# Altium project CAPTIVATE-PGMR.PrjPcb (part 1 of 3)
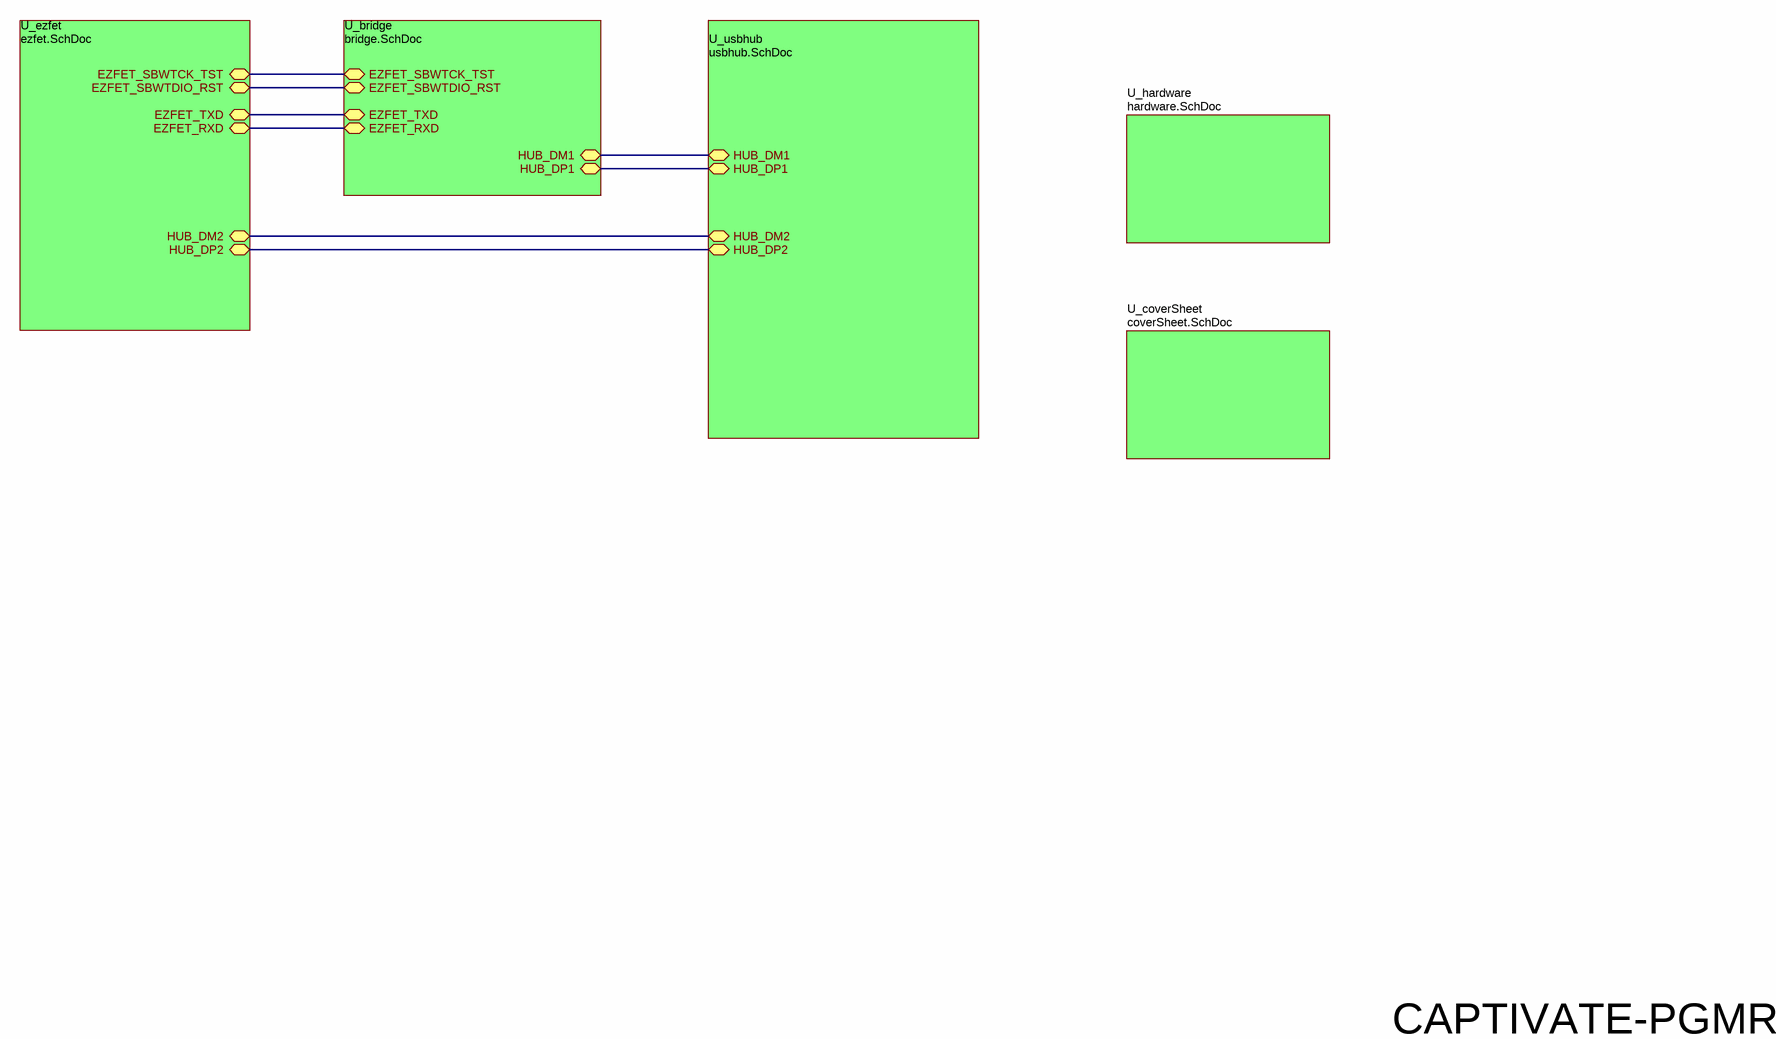
[diagram p0: TopSheet.SchDoc]
CopyrightYear: 2014; CountryOfManufacture: U.S.; EVM_orderable: CAPTIVATE-PGMR; PCB_Layout: Dennis Lehman; PCB_Rev: C; PRJ_Customer: Public Release; PRJ_Engineer: Dennis Lehman; PRJ_Number: CAPTIVATE-PGMR; PRJ_Title: TICAPEVM-430PGMR; SCH_Rev: B; TechSupport: http://www.ti.com/support; VariantName: Production Release
6 sheets, 160 parts. Net scope: hierarchical (ports join the sheet entries above them; power ports are global).
Board file: captivate_pgmr.PcbDoc
Sheets:
  TopSheet.SchDoc
    U_usbhub = usbhub.SchDoc
    U_ezfet = ezfet.SchDoc
    U_bridge = bridge.SchDoc
    U_hardware = hardware.SchDoc
    U_coverSheet = coverSheet.SchDoc

## Sheet TopSheet.SchDoc
size 431 x 279 mm; Date: Not shown in title block; ApprovedBy: Not shown in title block; CheckedBy: Not shown in title block; Author: Not shown in title block; CompanyName: Not shown in title block; Engineer: Not shown in title block; Organization: Not shown in title block; Address1: Not shown in title block; Address2: Not shown in title block; Address3: Not shown in title block; Address4: Not shown in title block; DocumentNumber: 6; Revision: Use project parameter SCH_Rev; SheetNumber: 6; SheetTotal: 6; PageSetup: Record=PageOptions|CenterHorizontal=True|CenterVertical=True|PrintScale=1.00|XCorrection=1.00|YCorrection=1.00|PrintKind=0|BorderSize=5000000|LeftOffset=0|BottomOffset=0|Orientation=2|PaperLength=1000|PaperWidth=1000|Scale=100|PaperSource=15|PrintQuality=600|MediaType=1|DitherType=10|PaperKind=Letter|PrintScaleMode=1; CurrentTime: Not shown in title block; CurrentDate: Not shown in title block; Time: Not shown in title block; DocumentFullPathAndName: Not shown in title block; DocumentName: Not shown in title block; ModifiedDate: Not shown in title block; ImagePath: Not shown in title block

### Sub-sheets
U_bridge = bridge.SchDoc: EZFET_SBWTCK_TST, EZFET_SBWTDIO_RST, EZFET_TXD (bidir), EZFET_RXD (bidir), HUB_DM1 (bidir), HUB_DP1 (bidir)
U_coverSheet = coverSheet.SchDoc: no entries
U_ezfet = ezfet.SchDoc: EZFET_SBWTDIO_RST, EZFET_SBWTCK_TST, EZFET_TXD (bidir), EZFET_RXD (bidir), HUB_DM2 (bidir), HUB_DP2 (bidir)
U_hardware = hardware.SchDoc: no entries
U_usbhub = usbhub.SchDoc: HUB_DM2 (bidir), HUB_DP2 (bidir), HUB_DM1 (bidir), HUB_DP1 (bidir)

### Nets
EZFET_RXD: sheet U_ezfet/EZFET_RXD, sheet U_bridge/EZFET_RXD
EZFET_SBWTCK_TST: sheet U_ezfet/EZFET_SBWTCK_TST, sheet U_bridge/EZFET_SBWTCK_TST
EZFET_SBWTDIO_RST: sheet U_ezfet/EZFET_SBWTDIO_RST, sheet U_bridge/EZFET_SBWTDIO_RST
EZFET_TXD: sheet U_ezfet/EZFET_TXD, sheet U_bridge/EZFET_TXD
HUB_DM1: sheet U_usbhub/HUB_DM1, sheet U_bridge/HUB_DM1
HUB_DM2: sheet U_usbhub/HUB_DM2, sheet U_ezfet/HUB_DM2
HUB_DP1: sheet U_usbhub/HUB_DP1, sheet U_bridge/HUB_DP1
HUB_DP2: sheet U_usbhub/HUB_DP2, sheet U_ezfet/HUB_DP2

### Notes on the sheet
- CAPTIVATE-PGMR
- Drawn By:
- SVN Rev:
- Number:
- TID #:
- Orderable:
- Rev:
- Sheet Title:
- File:
- Project Title:
- Designed for:
- Assembly Variant:
- Mod. Date:
- Sheet:
- Size:
- of
- B
- http://www.ti.com
- Texas Instruments and/or its licensors do not warrant the accuracy or completeness of this specification or any information contained therein. Texas Instruments and/or its licensors do not warrant that this design will meet the specifications, will be suitable for your application or fit for any particular purpose, or will operate in an implementation. Texas Instruments and/or its licensors do not warrant that the design is production worthy. You should completely validate and test your design implementation to confirm the system functionality for your application.
- Engineer:
- Contact:
- © Texas Instruments

## Sheet usbhub.SchDoc
size 431 x 279 mm; Date: Not shown in title block; ApprovedBy: Not shown in title block; CheckedBy: Not shown in title block; Author: Not shown in title block; CompanyName: Not shown in title block; Engineer: Not shown in title block; Organization: Not shown in title block; Address1: Not shown in title block; Address2: Not shown in title block; Address3: Not shown in title block; Address4: Not shown in title block; DocumentNumber: 2; Revision: Use project parameter SCH_Rev; SheetNumber: 2; SheetTotal: 6; PageSetup: Record=PageOptions|CenterHorizontal=True|CenterVertical=True|PrintScale=1.00|XCorrection=1.00|YCorrection=1.00|PrintKind=0|BorderSize=5000000|LeftOffset=0|BottomOffset=0|Orientation=2|PaperLength=1000|PaperWidth=1000|Scale=100|PaperSource=15|PrintQuality=600|MediaType=1|DitherType=10|PaperKind=Letter|PrintScaleMode=1; CurrentTime: Not shown in title block; CurrentDate: Not shown in title block; Time: Not shown in title block; DocumentFullPathAndName: Not shown in title block; DocumentName: Not shown in title block; ModifiedDate: Not shown in title block; ImagePath: Not shown in title block
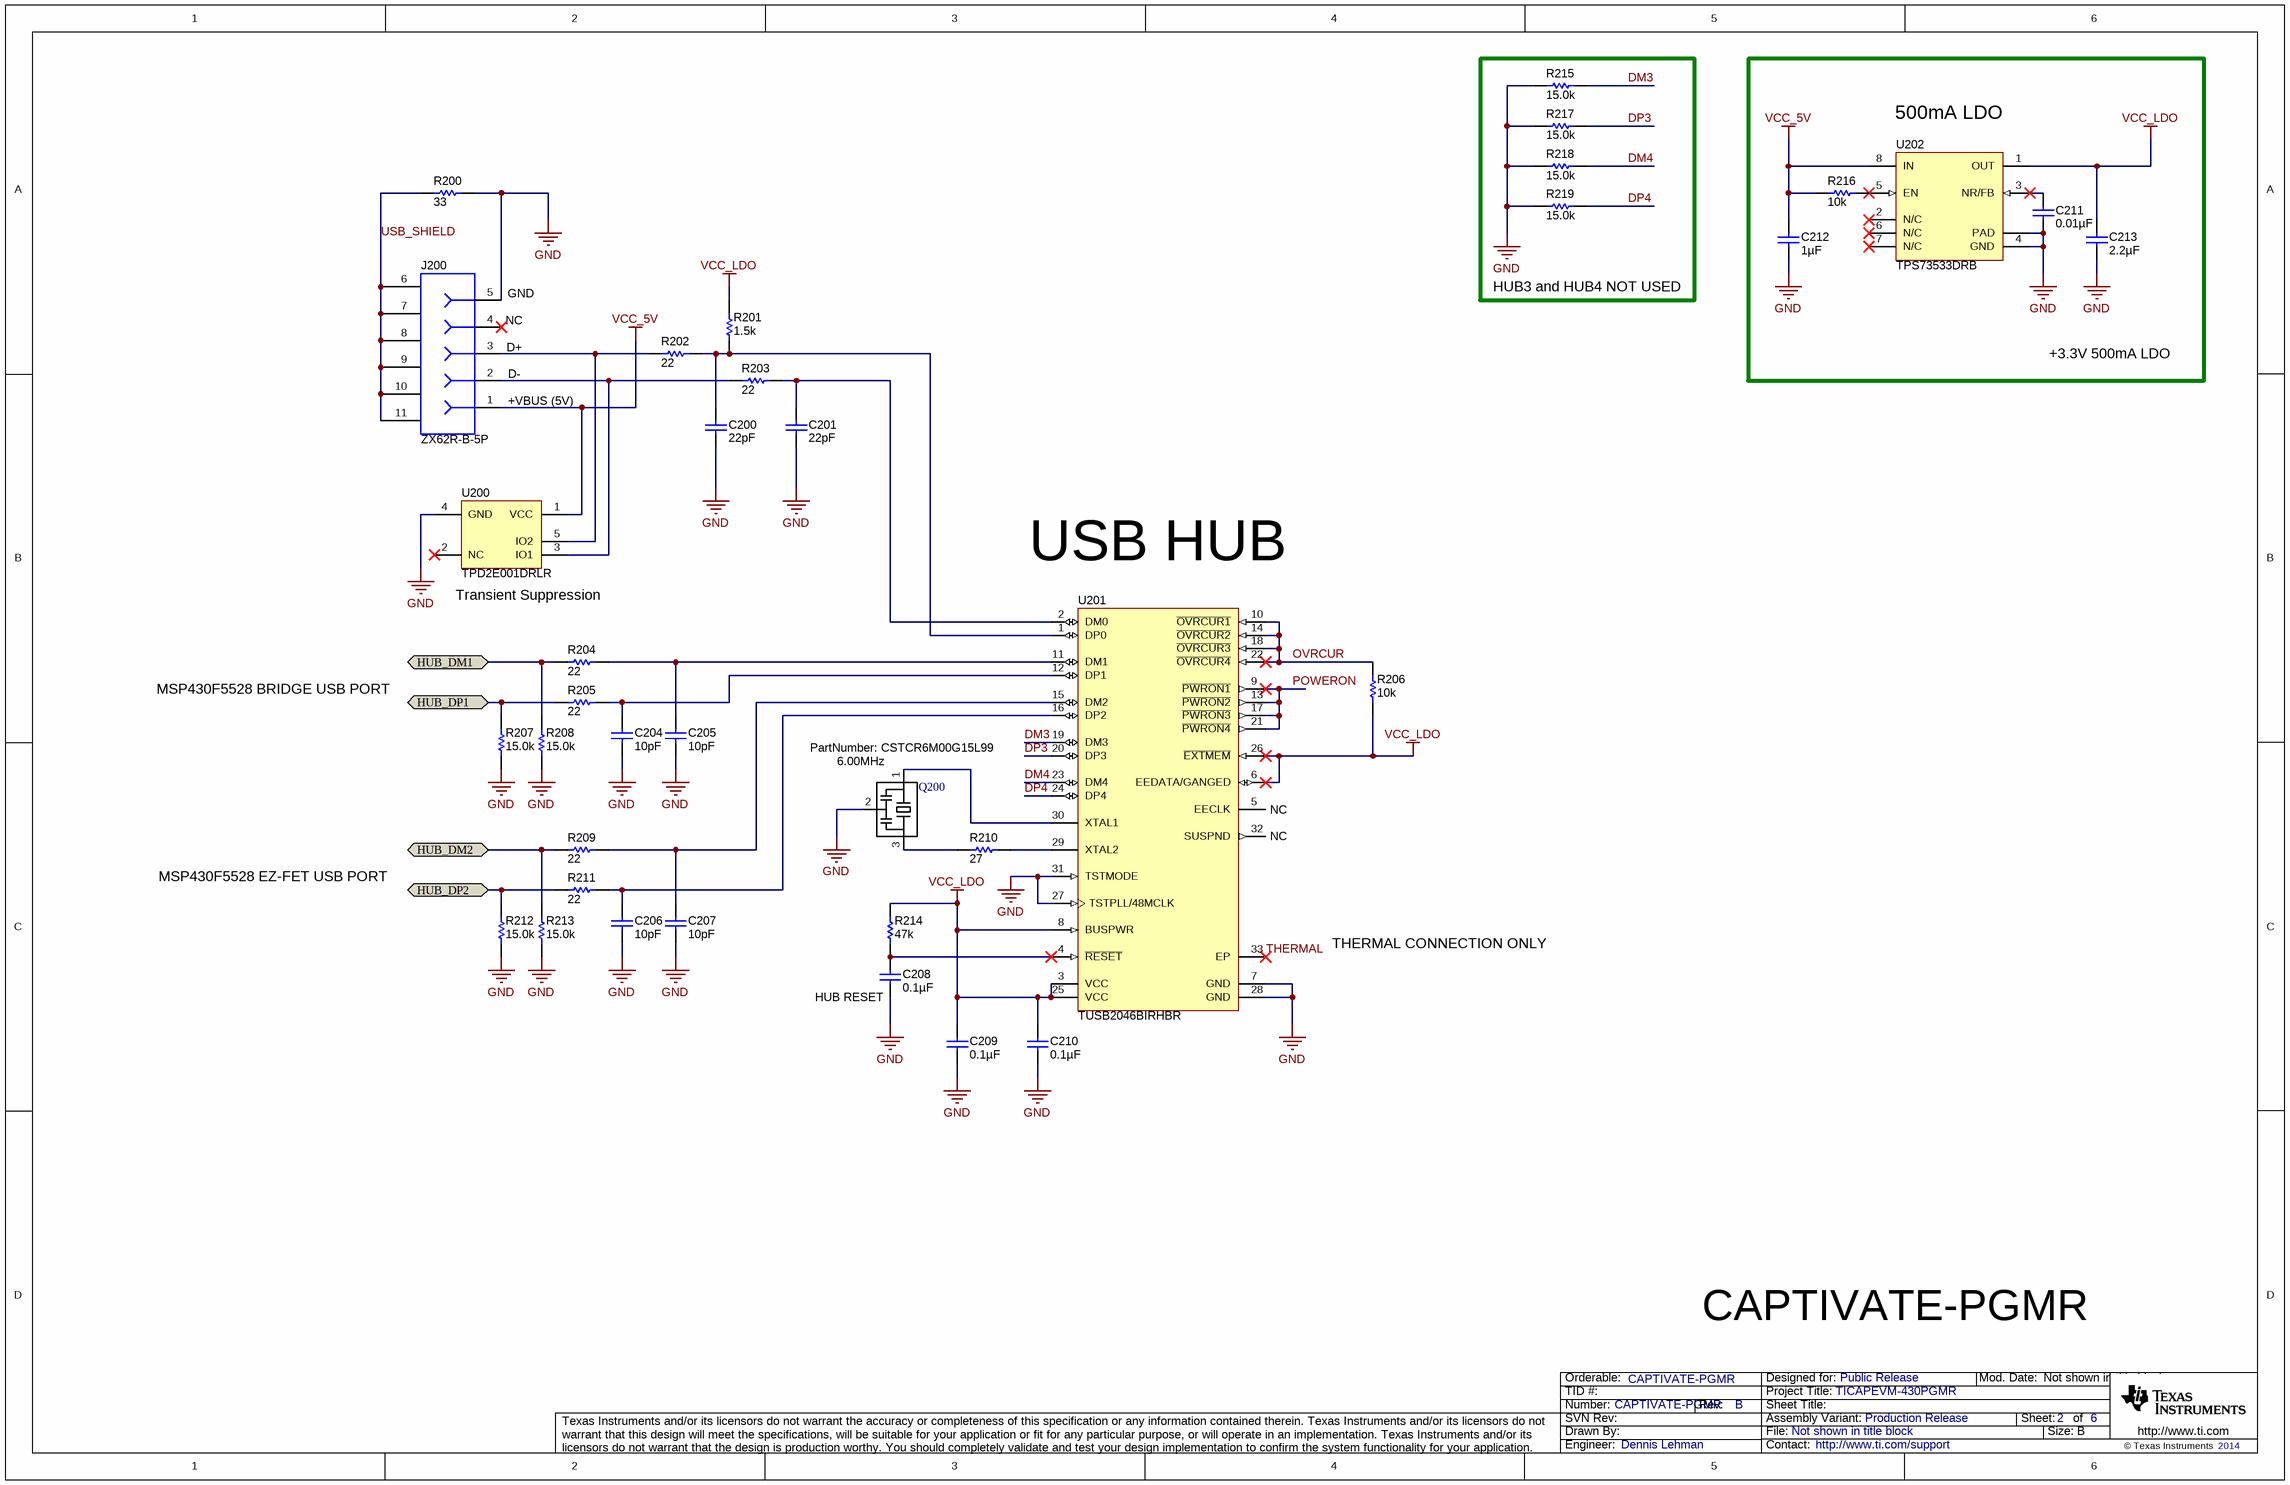
[diagram p1: usbhub.SchDoc]

### Parts
C200  ValueDisplayed: 22pF  [0402]  (hidden comment: GRM1555C1H220JA01D)
C201  ValueDisplayed: 22pF  [0402]  (hidden comment: GRM1555C1H220JA01D)
C204  ValueDisplayed: 10pF  [0402]  (hidden comment: GRM1555C1H100JA01D)
C205  ValueDisplayed: 10pF  [0402]  (hidden comment: GRM1555C1H100JA01D)
C206  ValueDisplayed: 10pF  [0402]  (hidden comment: GRM1555C1H100JA01D)
C207  ValueDisplayed: 10pF  [0402]  (hidden comment: GRM1555C1H100JA01D)
C208  ValueDisplayed: 0.1µF  [0402]  (hidden comment: GRM155R61C104KA88D)
C209  ValueDisplayed: 0.1µF  [0402]  (hidden comment: GRM155R61C104KA88D)
C210  ValueDisplayed: 0.1µF  [0402]  (hidden comment: GRM155R61C104KA88D)
C211  ValueDisplayed: 0.01µF  [0402]  (hidden comment: GRM155R61C103KA01D)
C212  ValueDisplayed: 1µF  [0603]  (hidden comment: C0603C105K8PACTU)
C213  ValueDisplayed: 2.2µF  [0603]  (hidden comment: C0603C225K8PACTU)
J200  ZX62R-B-5P  [CONN_USB_micro_ZX62R-B-5PA]
Q200  Value Displayed: 6.00MHz  PartNumber: CSTCR6M00G15L99  [CSTCR CERAMIC RESONATOR - MURATA]
R200  value 33  [0402]  (hidden comment: CRCW040233R0JNED)
R201  value 1.5k  [0402]  (hidden comment: CRCW04021K50JNED)
R202  value 22  [0402]  (hidden comment: CRCW040222R0JNED)
R203  value 22  [0402]  (hidden comment: CRCW040222R0JNED)
R204  value 22  [0402]  (hidden comment: CRCW040222R0JNED)
R205  value 22  [0402]  (hidden comment: CRCW040222R0JNED)
R206  ValueDisplayed: 10k  [0402]  (hidden comment: CRCW040210K0JNED)
R207  value 15.0k  [0402]  (hidden comment: CRCW040215K0FKED)
R208  value 15.0k  [0402]  (hidden comment: CRCW040215K0FKED)
R209  value 22  [0402]  (hidden comment: CRCW040222R0JNED)
R210  value 27  [0402]  (hidden comment: CRCW040227R0JNED)
R211  value 22  [0402]  (hidden comment: CRCW040222R0JNED)
R212  value 15.0k  [0402]  (hidden comment: CRCW040215K0FKED)
R213  value 15.0k  [0402]  (hidden comment: CRCW040215K0FKED)
R214  value 47k  [0402]  (hidden comment: CRCW040247K0JNED)
R215  value 15.0k  [0402]  (hidden comment: CRCW040215K0FKED)
R216  value 10k  [0402]  (hidden comment: CRCW040210K0JNED)
R217  value 15.0k  [0402]  (hidden comment: CRCW040215K0FKED)
R218  value 15.0k  [0402]  (hidden comment: CRCW040215K0FKED)
R219  value 15.0k  [0402]  (hidden comment: CRCW040215K0FKED)
U200  TPD2E001DRLR  [DRL0005A]
U201  TUSB2046BIRHBR  [RHB0032E]
U202  TPS73533DRB  [DRB0008A]

### Blocks framed on the sheet
HUB3 and HUB4 NOT USED: R215 R217-R219
500mA LDO: C211-C213 R216 U202

### Ports
HUB_DM1 (bidir), HUB_DM2 (bidir), HUB_DP1 (bidir), HUB_DP2 (bidir)

### Nets
GND: C200.2 C201.2 C204.2 C205.2 C206.2 C207.2 C208.2 C209.2 C210.2 C211.2 C212.2 C213.2 J200.5 Q200.2 R200.2 R207.1 R208.1 R212.1 R213.1 R215.1 R217.1 R218.1 R219.1 U200.4(GND) U201.7(GND) U201.27(TSTPLL/48MCLK) U201.28(GND) U201.31(TSTMODE) U202.4(GND) U202.9(PAD)
VCC_5V: C212.1 J200.1 R216.1 U200.1(VCC) U202.8(IN)
VCC_LDO: C209.1 C210.1 C213.1 R201.2 R206.1 R214.2 U201.3(VCC) U201.6(EEDATA/GANGED) U201.8(BUSPWR) U201.25(VCC) U201.26(~{EXTMEM}) U202.1(OUT)
DM3: R215.2 U201.19(DM3)
DM4: R218.2 U201.23(DM4)
DP3: R217.2 U201.20(DP3)
DP4: R219.2 U201.24(DP4)
HUB_DM1: R204.1 R208.2 ; port HUB_DM1
HUB_DM2: R209.1 R213.2 ; port HUB_DM2
HUB_DP1: R205.1 R207.2 ; port HUB_DP1
HUB_DP2: R211.1 R212.2 ; port HUB_DP2
OVRCUR: R206.2 U201.10(~{OVRCUR1}) U201.14(~{OVRCUR2}) U201.18(~{OVRCUR3}) U201.22(~{OVRCUR4})
POWERON: U201.9(~{PWRON1}) U201.13(~{PWRON2}) U201.17(~{PWRON3}) U201.21(~{PWRON4})
THERMAL: U201.33(EP)
USB_SHIELD: J200.6 J200.7 J200.8 J200.9 J200.10 J200.11 R200.1
NetC200_1: C200.1 R201.1 R202.2 U201.1(DP0)
NetC201_1: C201.1 R203.2 U201.2(DM0)
NetC204_1: C204.1 R205.2 U201.12(DP1)
NetC205_1: C205.1 R204.2 U201.11(DM1)
NetC206_1: C206.1 R211.2 U201.16(DP2)
NetC207_1: C207.1 R209.2 U201.15(DM2)
NetC208_1: C208.1 R214.1 U201.4(~{RESET})
NetC211_1: C211.1 U202.3(NR/FB)
NetJ200_2: J200.2 R203.1 U200.3(IO1)
NetJ200_3: J200.3 R202.1 U200.5(IO2)
NetQ200_1: Q200.1 U201.30(XTAL1)
NetQ200_3: Q200.3 R210.1
NetR210_2: R210.2 U201.29(XTAL2)
NetR216_2: R216.2 U202.5(EN)

Not connected (* = marked no-connect by the designer): J200 4*; U200 2(NC)*; U201 5(EECLK) 32(SUSPND); U202 2(N/C)* 6(N/C)* 7(N/C)*

### Notes on the sheet
- (near J200) GND
- (near J200) NC
- (near J200) D+
- +3.3V 500mA LDO
- (near J200) D-
- (near J200) +VBUS (5V)
- (near U201) USB HUB
- (near U200) Transient Suppression
- MSP430F5528 BRIDGE USB PORT
- (near U201) NC
- MSP430F5528 EZ-FET USB PORT
- THERMAL CONNECTION ONLY
- (near C208) HUB RESET
- CAPTIVATE-PGMR
- Drawn By:
- SVN Rev:
- Number:
- TID #:
- Orderable:
- Rev:
- Sheet Title:
- File:
- Project Title:
- Designed for:
- Assembly Variant:
- Mod. Date:
- Sheet:
- Size:
- of
- B
- http://www.ti.com
- Texas Instruments and/or its licensors do not warrant the accuracy or completeness of this specification or any information contained therein. Texas Instruments and/or its licensors do not warrant that this design will meet the specifications, will be suitable for your application or fit for any particular purpose, or will operate in an implementation. Texas Instruments and/or its licensors do not warrant that the design is production worthy. You should completely validate and test your design implementation to confirm the system functionality for your application.
- Engineer:
- Contact:
- © Texas Instruments

### Library data of the parts
C200 C201 = GRM1555C1H220JA01D: CAP, CERM, 22pF, 50V, +/-5%, C0G/NP0, 0402; Manufacturer: MuRata; Polarized: N; CompType: Capacitor; U/M: EA; Cap_F: 0.000000000022; Tolerance_%: 5; Value1: Unknown; VDC_V: 50; TaMin_C: -55; TaMax_C: 125; SymbolVersion: 2008-07-09; Value: 22pF; PartNumber: GRM1555C1H220JA01D; PackageReference: 0402; RoHS: Y; Value2: 50V; MountType: SMT; Technology: Ceramic; TempCo: C0G/NP0; Cap_Case: 0402; Published: 2008-06-19; Publisher: Texas Instruments; LatestRevisionDate: 2013-09-06; ComponentLink1Description: Datasheet link; ComponentLink1URL: http://search.murata.co.jp/Ceramy/PnsearchViewAction.do?HnOFG=ON&HnNFG=ON&SEL_CNT=50&sLang=en&sKey=GRM1555C1H220JA01D&x=9&y=9&search=startwith; Supplier 1: Mouser; Supplier Part Number 1: 81-GRM1555C1H220JA1D
C204-C207 = GRM1555C1H100JA01D: CAP, CERM, 10pF, 50V, +/-5%, C0G/NP0, 0402; Manufacturer: MuRata; Polarized: N; CompType: Capacitor; U/M: EA; Cap_F: 0.00000000001; Tolerance_%: 5; Value1: Unknown; VDC_V: 50; TaMin_C: -55; TaMax_C: 125; SymbolVersion: 2008-07-09; Value: 10pF; PartNumber: GRM1555C1H100JA01D; PackageReference: 0402; RoHS: Y; Value2: 50V; MountType: SMT; Technology: Ceramic; TempCo: C0G/NP0; Cap_Case: 0402; Published: 2008-06-19; Publisher: Texas Instruments; LatestRevisionDate: 2013-09-06; ComponentLink1Description: Datasheet link; ComponentLink1URL: http://search.murata.co.jp/Ceramy/PnsearchViewAction.do?HnOFG=ON&HnNFG=ON&SEL_CNT=50&sLang=en&sKey=GRM1555C1H100JA01D&x=9&y=9&search=startwith; Supplier 1: Mouser; Supplier Part Number 1: 81-GRM1555C1H100JA1D
C208-C210 = GRM155R61C104KA88D: CAP, CERM, 0.1uF, 16V, +/-10%, X5R, 0402; Manufacturer: MuRata; Polarized: N; CompType: Capacitor; U/M: EA; Cap_F: 0.0000001; Tolerance_%: 10; Value1: Unknown; VDC_V: 16; TaMin_C: -55; TaMax_C: 85; SymbolVersion: 2008-07-09; Value: 0.1uF; PartNumber: GRM155R61C104KA88D; PackageReference: 0402; RoHS: Y; Value2: 16V; MountType: SMT; Technology: Ceramic; TempCo: X5R; Cap_Case: 0402; Published: 2008-06-19; Publisher: Texas Instruments; LatestRevisionDate: 2013-09-06; ComponentLink1Description: Datasheet link; ComponentLink1URL: http://search.murata.co.jp/Ceramy/PnsearchViewAction.do?HnOFG=ON&HnNFG=ON&SEL_CNT=50&sLang=en&sKey=GRM155R61C104KA88D&x=9&y=9&search=startwith; Supplier 1: Digi-Key; Supplier Part Number 1: 490-5415-1-ND; Supplier 2: Mouser; Supplier Part Number 2: 81-GRM155R61C104KA8D
C211 = GRM155R61C103KA01D: CAP, CERM, 0.01uF, 16V, +/-10%, X5R, 0402; Manufacturer: MuRata; Polarized: N; CompType: Capacitor; U/M: EA; Cap_F: 0.00000001; Tolerance_%: 10; Value1: Unknown; VDC_V: 16; TaMin_C: -55; TaMax_C: 85; SymbolVersion: 2008-07-09; Value: 0.01uF; PartNumber: GRM155R61C103KA01D; PackageReference: 0402; RoHS: Y; Value2: 16V; MountType: SMT; Technology: Ceramic; TempCo: X5R; Cap_Case: 0402; Published: 2008-06-19; Publisher: Texas Instruments; LatestRevisionDate: 2013-09-06; ComponentLink1Description: Datasheet link; ComponentLink1URL: http://search.murata.co.jp/Ceramy/PnsearchViewAction.do?HnOFG=ON&HnNFG=ON&SEL_CNT=50&sLang=en&sKey=GRM155R61C103KA01D&x=9&y=9&search=startwith; Supplier 1: Digi-Key; Supplier Part Number 1: GRM155R61C103KA01D-ND; Supplier 2: Mouser; Supplier Part Number 2: 81-GRM155R61C103KA1D
C212 = C0603C105K8PACTU: CAP, CERM, 1uF, 10V, +/-10%, X5R, 0603; Manufacturer: Kemet; Polarized: N; CompType: Capacitor; U/M: EA; Cap_F: 0.000001; Tolerance_%: 10; Value1: Unknown; TaMin_C: -55; TaMax_C: 85; SymbolVersion: 2008-07-09; Value: 1uF; PartNumber: C0603C105K8PACTU; PackageReference: 0603; RoHS: Y; VDC_V: 10; Value2: 10V; MountType: SMT; Technology: Ceramic; TempCo: X5R; Cap_Case: 0603; Published: 2008-06-19; Publisher: Texas Instruments; LatestRevisionDate: 2013-09-06; ComponentLink1Description: Datasheet link; ComponentLink1URL: http://www.kemet.com/kemet/web/homepage/kechome.nsf/vapubfiles/F3102_Y5V.pdf/$file/F3102_Y5V.pdf; Supplier 1: Digi-Key; Supplier Part Number 1: 399-3118-1-ND; Supplier 2: Mouser; Supplier Part Number 2: 80-C0603C105K8P; Supplier 3: Farnell; Supplier Part Number 3: 9227776
C213 = C0603C225K8PACTU: CAP, CERM, 2.2uF, 10V, +/-10%, X5R, 0603; Manufacturer: Kemet; Polarized: N; CompType: Capacitor; U/M: EA; Cap_F: 0.0000022; Tolerance_%: 10; Value1: Unknown; TaMin_C: -55; TaMax_C: 85; SymbolVersion: 2008-07-09; Value: 2.2uF; PartNumber: C0603C225K8PACTU; PackageReference: 0603; RoHS: Y; VDC_V: 10; Value2: 10V; MountType: SMT; Technology: Ceramic; TempCo: X5R; Cap_Case: 0603; Published: 2008-06-19; Publisher: Texas Instruments; LatestRevisionDate: 2013-09-06; ComponentLink1Description: Datasheet link; ComponentLink1URL: http://www.kemet.com/kemet/web/homepage/kechome.nsf/vapubfiles/F3102_Y5V.pdf/$file/F3102_Y5V.pdf; Supplier 1: Digi-Key; Supplier Part Number 1: 399-4911-1-ND; Supplier 2: Mouser; Supplier Part Number 2: 80-C0603C225K8P; Supplier 3: Farnell; Supplier Part Number 3: 1108322
J200 = ZX62R-B-5P: Connector, micro USB Type B, Reverse, Receptacle, SMD; Manufacturer: Hirose Electric Co. Ltd.; SymbolCreator: a0411947; U/M: EA; SymbolVersion: 2013-04-05; PartNumber: ZX62R-B-5P; CompType: Receptacle; RoHS: Y; PackageReference: Micro USB-B receptacle (reverse); MountType: SMT; ComponentLink1Description: Datasheet Link; ComponentLink1URL: http://www.hirose.co.jp/cataloge_hp/e24200011.pdf; Publisher: Texas Instruments; LatestRevisionDate: 2013-09-09; Supplier 1: Digi-Key; Supplier Part Number 1: H11574CT-ND; Supplier 2: Mouser; Supplier 3: Farnell
Q200 = MURATA-FILTER_CSTCR6M00G15: 6.00MHz resonator; Supplier 1: Murata; Supplier Part Number 1: CSTCR6M00G15L99
R200 = CRCW040233R0JNED: RES, 33 ohm, 5%, 0.063W, 0402; Manufacturer: Vishay-Dale; CompType: Resistor; Value_Code: 33R0; Tolerance_%: 5; Power_W: 0.063; VDC_V: 50; TempCo: 200 ppm/C; EIA_Code: E24; U/M: EA; SymbolVersion: 2009-05-29; PartNumber: CRCW040233R0JNED; PackageReference: 0402; RoHS: Y; Res_ohm: 33; Value1: 5%; Value2: 0.063W; MountType: SMT; Technology: Thick Film; Published: 2008-06-26; Publisher: Texas Instruments; LatestRevisionDate: 2013-01-08; ComponentLink1Description: Datasheet link; ComponentLink1URL: http://www.vishay.com/docs/20035/dcrcwe3.pdf; Supplier 1: Digi-Key; Supplier Part Number 1: 541-33JCT-ND; Supplier 2: Mouser; Supplier Part Number 2: 71-CRCW0402J-33-E3; Supplier 3: Farnell; Supplier Part Number 3: 1556592
R201 = CRCW04021K50JNED: RES, 1.5k ohm, 5%, 0.063W, 0402; Manufacturer: Vishay-Dale; CompType: Resistor; Res_ohm: 1500; Value_Code: 1k50; Tolerance_%: 5; Power_W: 0.063; VDC_V: 50; TempCo: 200 ppm/C; EIA_Code: E24; U/M: EA; SymbolVersion: 2009-05-29; PartNumber: CRCW04021K50JNED; PackageReference: 0402; RoHS: Y; Value1: 5%; Value2: 0.063W; MountType: SMT; Technology: Thick Film; Published: 2008-06-26; Publisher: Texas Instruments; LatestRevisionDate: 2013-01-08; ComponentLink1Description: Datasheet link; ComponentLink1URL: http://www.vishay.com/docs/20035/dcrcwe3.pdf; Supplier 1: Digi-Key; Supplier Part Number 1: 541-1.5KJCT-ND; Supplier 2: Farnell; Supplier Part Number 2: 1558782; Supplier 3: Newark; Supplier Part Number 3: 72M6746
R202-R205 R209 R211 = CRCW040222R0JNED: RES, 22 ohm, 5%, 0.063W, 0402; Manufacturer: Vishay-Dale; CompType: Resistor; Value_Code: 22R0; Tolerance_%: 5; Power_W: 0.063; VDC_V: 50; TempCo: 200 ppm/C; EIA_Code: E24; U/M: EA; SymbolVersion: 2009-05-29; PartNumber: CRCW040222R0JNED; PackageReference: 0402; RoHS: Y; Res_ohm: 22; Value1: 5%; Value2: 0.063W; MountType: SMT; Technology: Thick Film; Published: 2008-06-26; Publisher: Texas Instruments; LatestRevisionDate: 2013-01-08; ComponentLink1Description: Datasheet link; ComponentLink1URL: http://www.vishay.com/docs/20035/dcrcwe3.pdf; Supplier 1: Digi-Key; Supplier Part Number 1: 541-22JCT-ND; Supplier 2: Mouser; Supplier Part Number 2: 71-CRCW0402J-22-E3; Supplier 3: Farnell; Supplier Part Number 3: 1514685
R206 = CRCW040210K0JNED: RES, 10 k, 5%, 0.063 W, 0402; Manufacturer: Vishay-Dale; CompType: Resistor; Value: 10k; Res_ohm: 10000; Value_Code: 10k0; Tolerance_%: 5; Power_W: 0.063; Value2: 0.063W; VDC_V: 50; TempCo: 200 ppm/C; EIA_Code: E24; U/M: EA; SymbolVersion: 2009-05-29; PartNumber: CRCW040210K0JNED; PackageReference: 0402; RoHS: Y; Value1: 5%; MountType: SMT; Technology: Thick Film; Published: 2008-06-26; Publisher: Texas Instruments; LatestRevisionDate: 2014-09-20; ComponentLink1Description: Datasheet link; ComponentLink1URL: http://www.vishay.com/docs/20035/dcrcwe3.pdf; Supplier 1: Digi-Key; Supplier Part Number 1: 541-10KJCT-ND; Supplier 2: Mouser; Supplier Part Number 2: 71-CRCW0402J-10K-E3; Supplier 3: Farnell; Supplier Part Number 3: 1514663
R207 R208 R212 R213 R215 R217-R219 = CRCW040215K0FKED: RES, 15.0k ohm, 1%, 0.063W, 0402; Manufacturer: Vishay-Dale; CompType: Resistor; Res_ohm: 15000; Value_Code: 15k0; Tolerance_%: 1; Power_W: 0.063; VDC_V: 50; TempCo: 100 ppm/C; EIA_Code: E96; U/M: EA; SymbolVersion: 2009-05-29; PartNumber: CRCW040215K0FKED; PackageReference: 0402; RoHS: Y; Value1: 1%; Value2: 0.063W; MountType: SMT; Technology: Thick Film; Published: 2008-06-26; Publisher: Texas Instruments; LatestRevisionDate: 2013-01-08; ComponentLink1Description: Datasheet link; ComponentLink1URL: http://www.vishay.com/docs/20035/dcrcwe3.pdf; Supplier 1: Digi-Key; Supplier Part Number 1: 541-15.0KLCT-ND; Supplier 2: Mouser; Supplier Part Number 2: 71-CRCW0402-15K-E3; Supplier 3: Farnell; Supplier Part Number 3: 1469683
R210 = CRCW040227R0JNED: RES, 27 ohm, 5%, 0.063W, 0402; Manufacturer: Vishay-Dale; CompType: Resistor; Value_Code: 27R0; Tolerance_%: 5; Power_W: 0.063; VDC_V: 50; TempCo: 200 ppm/C; EIA_Code: E24; U/M: EA; SymbolVersion: 2009-05-29; PartNumber: CRCW040227R0JNED; PackageReference: 0402; RoHS: Y; Res_ohm: 27; Value1: 5%; Value2: 0.063W; MountType: SMT; Technology: Thick Film; Published: 2008-06-26; Publisher: Texas Instruments; LatestRevisionDate: 2013-01-08; ComponentLink1Description: Datasheet link; ComponentLink1URL: http://www.vishay.com/docs/20035/dcrcwe3.pdf; Supplier 1: Digi-Key; Supplier Part Number 1: 541-27JCT-ND; Supplier 2: Mouser; Supplier Part Number 2: 71-CRCW0402J-27-E3; Supplier 3: Farnell; Supplier Part Number 3: 1514690
R214 = CRCW040247K0JNED: RES, 47k ohm, 5%, 0.063W, 0402; Manufacturer: Vishay-Dale; CompType: Resistor; Res_ohm: 47000; Value_Code: 47k0; Tolerance_%: 5; Power_W: 0.063; VDC_V: 50; TempCo: 200 ppm/C; EIA_Code: E24; U/M: EA; SymbolVersion: 2009-05-29; PartNumber: CRCW040247K0JNED; PackageReference: 0402; RoHS: Y; Value1: 5%; Value2: 0.063W; MountType: SMT; Technology: Thick Film; Published: 2008-06-26; Publisher: Texas Instruments; LatestRevisionDate: 2013-01-08; ComponentLink1Description: Datasheet link; ComponentLink1URL: http://www.vishay.com/docs/20035/dcrcwe3.pdf; Supplier 1: Digi-Key; Supplier Part Number 1: 541-47KJCT-ND; Supplier 2: Farnell; Supplier Part Number 2: 1514553; Supplier 3: Newark; Supplier Part Number 3: 52K7099
R216 = CRCW040210K0JNED: RES, 10k ohm, 5%, 0.063W, 0402; Manufacturer: Vishay-Dale; CompType: Resistor; Res_ohm: 10000; Value_Code: 10k0; Tolerance_%: 5; Power_W: 0.063; VDC_V: 50; TempCo: 200 ppm/C; EIA_Code: E24; U/M: EA; SymbolVersion: 2009-05-29; PartNumber: CRCW040210K0JNED; PackageReference: 0402; RoHS: Y; Value1: 5%; Value2: 0.063W; MountType: SMT; Technology: Thick Film; Published: 2008-06-26; Publisher: Texas Instruments; LatestRevisionDate: 2013-01-08; ComponentLink1Description: Datasheet link; ComponentLink1URL: http://www.vishay.com/docs/20035/dcrcwe3.pdf; Supplier 1: Digi-Key; Supplier Part Number 1: 541-10KJCT-ND; Supplier 2: Farnell; Supplier Part Number 2: 1514663; Supplier 3: Newark; Supplier Part Number 3: 59M6696
U200 = TPD2E001DRLR: Low-Capacitance + / - 15 kV ESD-Protection Array for High-Speed Data Interfaces, 2 Channels, -40 to +85 degC, 5-pin SOT (DRL), Green (RoHS & no Sb/Br); Manufacturer: Texas Instruments; Alternate Manufacturer: None; Alternate PartNumber: Equivalent; Breakdown Voltage(Min)(V): 11; IEC 61000-4-2 Air-Gap(+/- kV): 15; IEC 61000-4-2 Contact(+/- kV): 8; IO Capacitance(Typ)(pF): 1.5; IO Leakage Current(nA): 1; SubFamily: ESD Solution; USB High Speed: TRUE; DatasheetVersion: SLLS684F; PackageVersion: revD, Aug-2007; PackageReference: DRL0005A; PackageDescription: 5-Pin Plastic Small Outline, Flat Lead 0.5 mm Pitch; Supplier 1: Digi-Key; Supplier Part Number 1: 296-21883-2-ND; Supplier 2: Digi-Key; Supplier Part Number 2: 296-21883-1-ND; Supplier 3: Digi-Key; Supplier Part Number 3: 296-21883-6-ND; Supplier 4: Farnell; Supplier Part Number 4: 1412055; Supplier 5: Newark; Supplier Part Number 5: 41M5840; Supplier 6: Mouser; Supplier Part Number 6: 595-TPD2E001DRLR; Eco-Plan: Green (RoHS & no Sb/Br); MountType: SMT; PartNumber: TPD2E001DRLR; ComponentLink1Description: Datasheet; ComponentLink1URL: http://www.ti.com/general/docs/lit/getliterature.tsp?genericPartNumber=TPD2E001&fileType=pdf; ComponentLink2Description: URL Link1; ComponentLink2URL: SamplesURL:http://www.ti.com/product/tpd2e001#samples
U201 = TUSB2046BIRHBR: 4-Port Full-Speed USB Hub, 3.3V, -40 to 85 degC, 32-Pin QFN (RHB), Green (RoHS & no Sb/Br); Manufacturer: Texas Instruments; Alternate Manufacturer: None; Alternate PartNumber: Equivalent; SubFamily: USB Hub Controller; USB Speed: Full; USB Full Speed: True; Supply Voltage(s)(V): 3.3; DatasheetVersion: SLLS413H; PackageVersion: revD, Jun-2011; PackageReference: RHB0032E; PackageDescription: 32-Pin Plastic Quad Flat No-Lead, 5 x 5 mm Body, 0.5 mm Pitch, 3.45 x 3.45 mm Exposed Pad; Supplier 1: Digi-Key; Supplier Part Number 1: 296-21926-2-ND; Supplier 2: Digi-Key; Supplier Part Number 2: 296-21926-1-ND; Supplier 3: Digi-Key; Supplier Part Number 3: 296-21926-6-ND; Supplier 4: Newark; Supplier Part Number 4: 46M1363; Supplier 5: Mouser; Supplier Part Number 5: 595-TUSB2046BIRHBR; PartNumber: TUSB2046BIRHBR; MountType: SMT; Eco-Plan: Green (RoHS & no Sb/Br); Integrated MCU Architecture: N/A; Code_JEDEC: MO-220; ComponentLink1Description: Datasheet; ComponentLink1URL: http://www.ti.com/general/docs/lit/getliterature.tsp?genericPartNumber=TUSB2046B&fileType=pdf
U202 = TPS73533DRB: 500mA, Low Quiescent Current, Ultra-Low Noise, High PSRR Low-Dropout Linear Regulator, DRB0008A; Alternate Manufacturer: None; Manufacturer: Texas Instruments; SymbolCreator: a0411947; CompType: IC; U/M: EA; SymbolVersion: 2013-07-12; PartNumber: TPS73533DRB; PackageReference: DRB0008A; MountType: SMT; ComponentLink1Description: Datasheet Link; ComponentLink1URL: http://www.ti.com/lit/ds/symlink/tps73533.pdf; RoHS: Y; Publisher: Texas Instruments; LatestRevisionDate: 2013-09-05; LatestRevisionNote: Added Parts